# EAGLE design sensor (EAGLE 8.0.2)
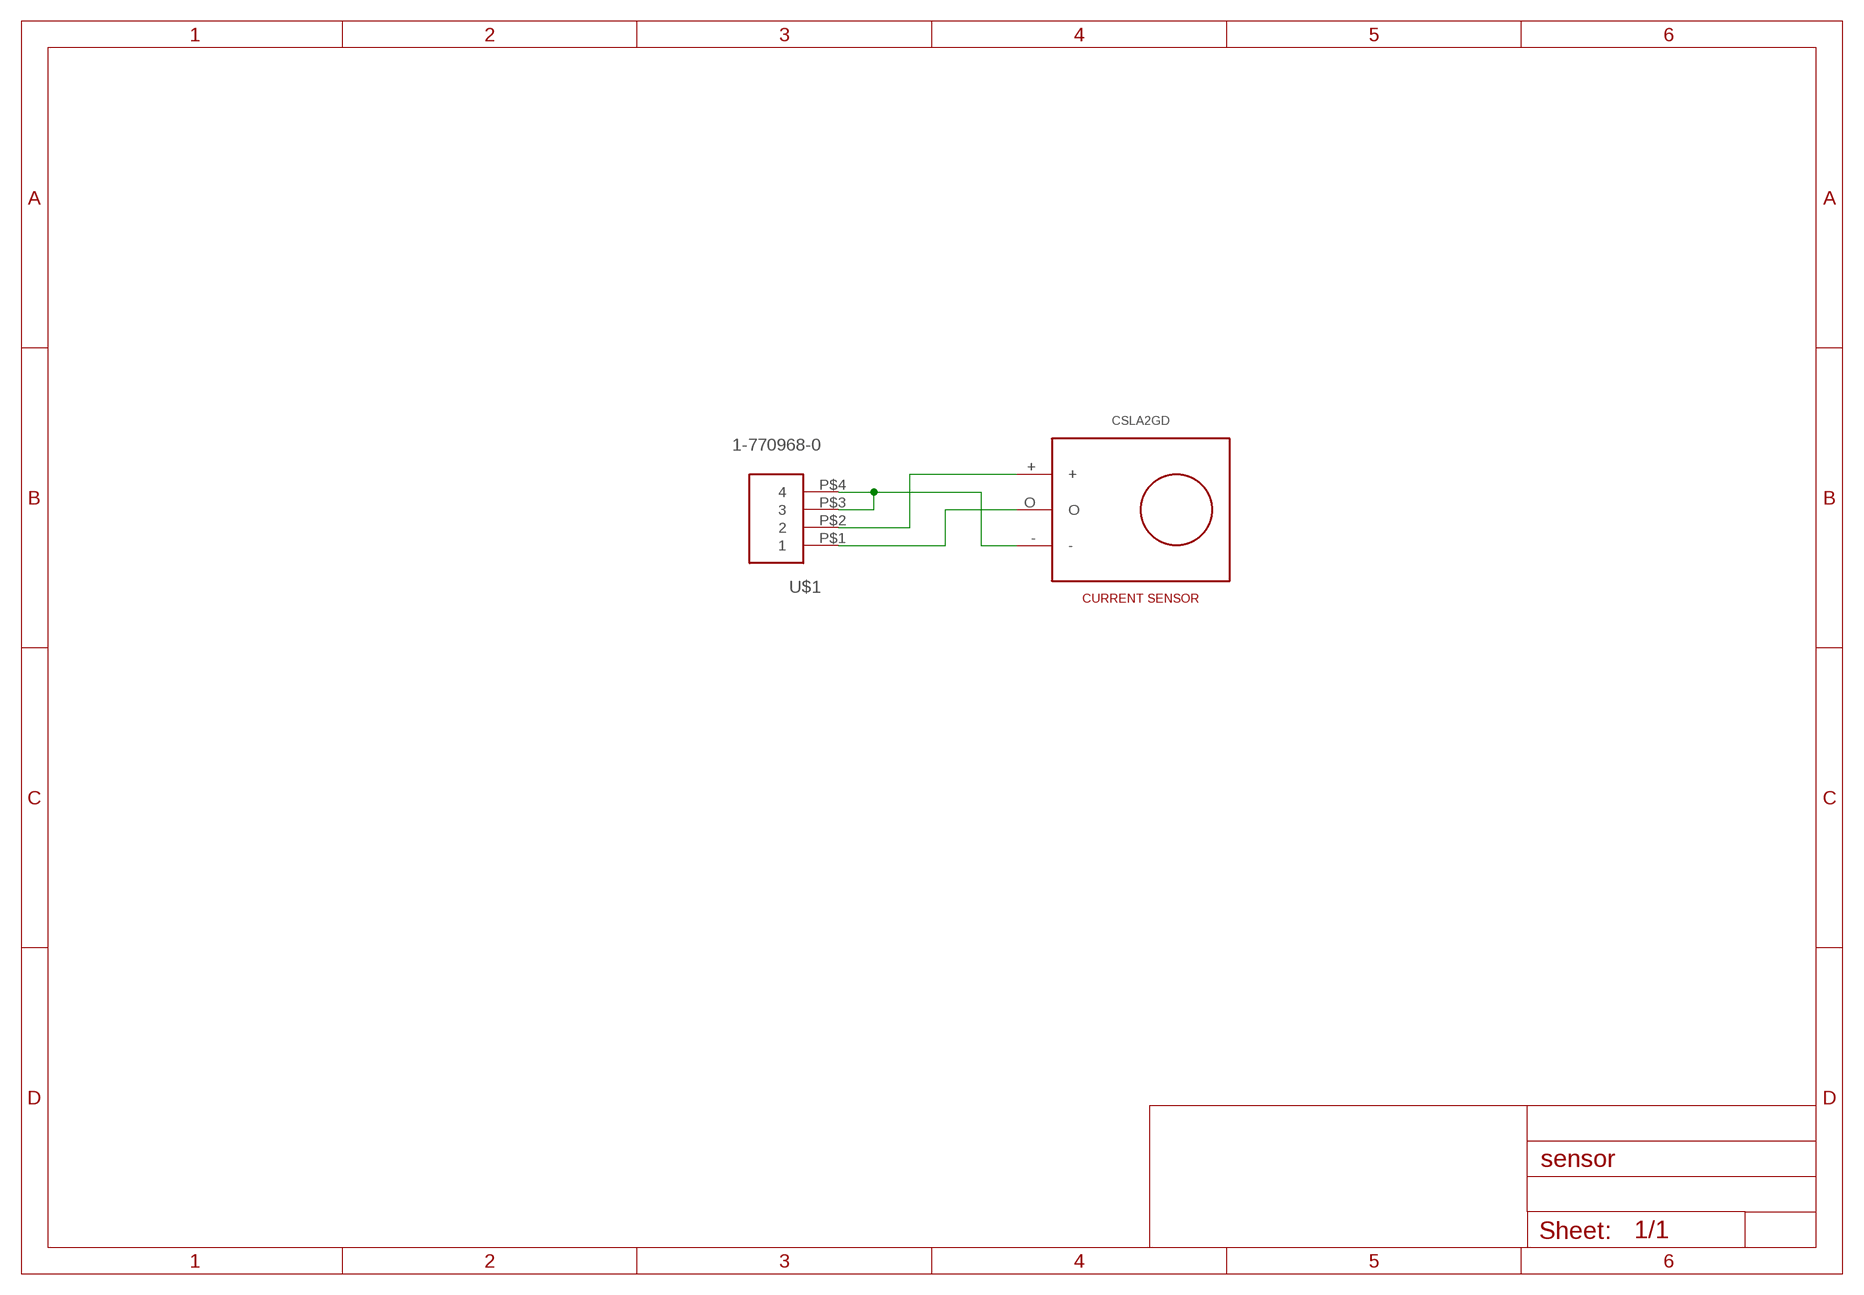
[diagram p0: schematic, sheet 1]

## Parts
U$1  1-770968-0  [1-770968-0]
U$2  CSLA2GD  [CSLA2GD]

## Nets
N$1: U$1.P$1 U$2.O
N$2: U$1.P$2 U$2.+
N$3: U$1.P$3 U$1.P$4 U$2.-

## Library data of the parts
U$1 = kotuku:1-770968-0
U$2 = kotuku:CSLA2GD

## Board
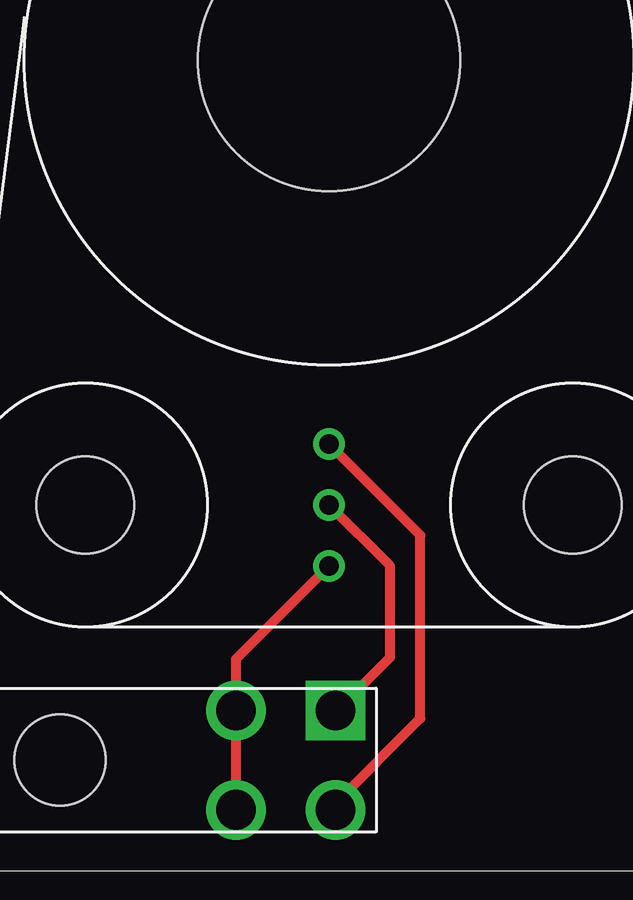
[diagram p1: board, top side]

No outline drawn. Coordinates in mm, seen from the top.
Copper layers (1*16): Top 0.035mm / dielectric 1.5mm / Bottom 0.035mm
Design rules "default": minimum track width 10mil, minimum drill 24mil, track to track 8mil, track to pad 8mil, pad to pad 8mil, via to via 8mil, smd to smd 8mil, copper to edge 40mil, drill to drill 8mil, minimum pad ring 10mil, minimum via ring 8mil, stop-mask expansion 4mil, vias tented up to drill 0mil, thermal gap 10mil

### Footprints (pad centres in the part's own frame; a part is rotated, then mirrored left to right if it is on the bottom)
1-770968-0 = drill 1.651 square: P$1 -2.07,16.81 | drill 1.651: P$2 2.07,16.81; P$3 -2.07,12.67; P$4 2.07,12.67 | hole 3.8: 0,5.33
CSLA2GD = drill 0.8: + 0,7.62; - 0,2.54; O 0,5.08 | hole 4.064: 10.16,5.08; -10.16,5.08 | hole 10.922: 0,23.622

### Placement (x,y rotation side)
U$1  -0.03,4.61 270 top
U$2  16.51,10.16 0 top

### Tracks (layer width: path | path; a pad name or v marks a point on that pad's centre or on a via)
N$1
  Top 0.406: U$1.P$1 16.84,6.68 19.05,8.89 19.05,12.7 U$2.O
N$2
  Top 0.406: U$1.P$2 16.78,2.81 20.32,6.35 20.32,13.97 U$2.+
N$3
  Top 0.406: U$1.P$4 U$1.P$3 12.64,8.83 U$2.-